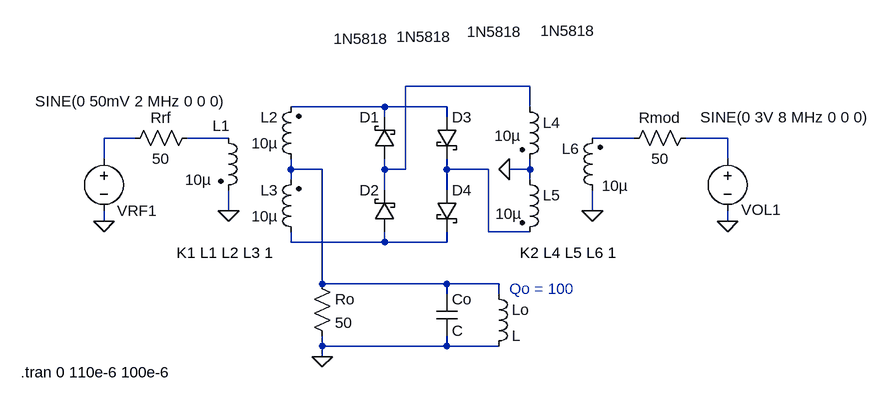
[diagram p0: schematic mixer_a.asc]
mixer_a.asc, the LTspice schematic file:
Version 4
SHEET 1 880 680
WIRE 272 -128 80 -128
WIRE 48 -96 -96 -96
WIRE 144 -96 48 -96
WIRE 272 -96 272 -128
WIRE 48 -80 48 -96
WIRE 144 -80 144 -96
WIRE -336 -48 -384 -48
WIRE -192 -48 -256 -48
WIRE 432 -48 368 -48
WIRE 576 -48 512 -48
WIRE -384 -16 -384 -48
WIRE 576 -16 576 -48
WIRE -96 0 -96 -16
WIRE -48 0 -96 0
WIRE 48 0 48 -16
WIRE 80 0 80 -128
WIRE 80 0 48 0
WIRE 144 0 144 -16
WIRE 208 0 144 0
WIRE 272 0 272 -16
WIRE 272 0 240 0
WIRE -96 16 -96 0
WIRE 272 16 272 0
WIRE 48 32 48 0
WIRE 144 32 144 0
WIRE -192 64 -192 32
WIRE 368 64 368 32
WIRE -384 80 -384 64
WIRE 576 80 576 64
WIRE 208 96 208 0
WIRE 272 96 208 96
WIRE -96 112 -96 96
WIRE 48 112 48 96
WIRE 48 112 -96 112
WIRE 144 112 144 96
WIRE 144 112 48 112
WIRE -48 176 -48 0
WIRE 144 176 -48 176
WIRE 224 176 144 176
WIRE 144 192 144 176
WIRE 224 192 224 176
WIRE -48 272 -48 256
WIRE 144 272 144 256
WIRE 144 272 -48 272
WIRE 224 272 144 272
WIRE -48 288 -48 272
FLAG 368 64 0
FLAG -192 64 0
FLAG 240 0 0
FLAG 576 80 0
FLAG -384 80 0
FLAG -48 288 0
SYMBOL ind2 -208 -64 R0
WINDOW 0 -9 -3 Left 2
WINDOW 3 -51 80 Left 2
SYMATTR InstName L1
SYMATTR Value 10µ
SYMATTR Type ind
SYMBOL ind2 -80 0 R180
WINDOW 0 36 80 Left 2
WINDOW 3 36 40 Left 2
SYMATTR InstName L2
SYMATTR Value 10µ
SYMATTR Type ind
SYMBOL ind2 -80 112 R180
WINDOW 0 36 80 Left 2
WINDOW 3 36 40 Left 2
SYMATTR InstName L3
SYMATTR Value 10µ
SYMATTR Type ind
SYMBOL ind2 256 -112 R0
WINDOW 3 -39 60 Left 2
SYMATTR InstName L4
SYMATTR Value 10µ
SYMATTR Type ind
SYMBOL ind2 256 0 R0
WINDOW 3 -37 68 Left 2
SYMATTR InstName L5
SYMATTR Value 10µ
SYMATTR Type ind
SYMBOL ind2 384 48 R180
WINDOW 0 36 80 Left 2
WINDOW 3 -39 23 Left 2
SYMATTR InstName L6
SYMATTR Value 10µ
SYMATTR Type ind
SYMBOL res -240 -64 R90
WINDOW 0 0 56 VBottom 2
WINDOW 3 32 56 VTop 2
SYMATTR InstName Rrf
SYMATTR Value 50
SYMBOL res 528 -64 R90
WINDOW 0 0 56 VBottom 2
WINDOW 3 32 56 VTop 2
SYMATTR InstName Rmod
SYMATTR Value 50
SYMBOL schottky 64 -16 R180
WINDOW 0 24 64 Left 2
WINDOW 3 10 185 Left 2
SYMATTR InstName D1
SYMATTR Value 1N5818
SYMATTR Description Diode
SYMATTR Type diode
SYMBOL schottky 64 96 R180
WINDOW 0 24 64 Left 2
WINDOW 3 -87 300 Left 2
SYMATTR InstName D2
SYMATTR Value 1N5818
SYMATTR Description Diode
SYMATTR Type diode
SYMBOL schottky 128 -80 R0
WINDOW 3 47 -132 Left 2
SYMATTR InstName D3
SYMATTR Value 1N5818
SYMATTR Description Diode
SYMATTR Type diode
SYMBOL schottky 128 32 R0
WINDOW 3 160 -245 Left 2
SYMATTR InstName D4
SYMATTR Value 1N5818
SYMATTR Description Diode
SYMATTR Type diode
SYMBOL voltage 576 -32 R0
WINDOW 0 21 94 Left 2
WINDOW 3 -42 -48 Left 2
WINDOW 123 0 0 Left 0
WINDOW 39 0 0 Left 0
SYMATTR InstName VOL1
SYMATTR Value SINE(0 3V 8 MHz 0 0 0)
SYMBOL voltage -384 -32 R0
WINDOW 0 20 96 Left 2
WINDOW 3 -106 -73 Left 2
WINDOW 123 0 0 Left 0
WINDOW 39 0 0 Left 0
SYMATTR InstName VRF1
SYMATTR Value SINE(0 50mV 2 MHz 0 0 0)
SYMBOL res -64 160 R0
SYMATTR InstName Ro
SYMATTR Value 50
SYMBOL cap 128 192 R0
SYMATTR InstName Co
SYMBOL ind 208 176 R0
SYMATTR InstName Lo
TEXT -272 128 Left 2 !K1 L1 L2 L3 1
TEXT 256 128 Left 2 !K2 L4 L5 L6 1
TEXT -512 312 Left 2 !.tran 0 110e-6 100e-6
TEXT 240 184 Left 2 ;Qo = 100

The netlist it stands for:
* mixer_a.asc
L1 N004 0 10µ
L2 N007 N002 10µ
L3 N009 N007 10µ
L4 N001 0 10µ
L5 0 N008 10µ
L6 0 N005 10µ
Rrf N004 N003 50
Rmod N006 N005 50
D1 N001 N002 1N5818
D2 N009 N001 1N5818
D3 N002 N008 1N5818
D4 N008 N009 1N5818
VOL1 N006 0 SINE(0 3V 8 MHz 0 0 0)
VRF1 N003 0 SINE(0 50mV 2 MHz 0 0 0)
Ro N007 0 50
Co N007 0 C
Lo N007 0 L
.model D D
.lib standard.dio
K1 L1 L2 L3 1
K2 L4 L5 L6 1
.tran 0 110e-6 100e-6
* Qo = 100
.backanno
.end